# Altium schematic sheet HC IR SSR DRIVER.SchDoc
size A4; DocumentNumber: 4; SheetNumber: ALT0056; SheetTotal: 21
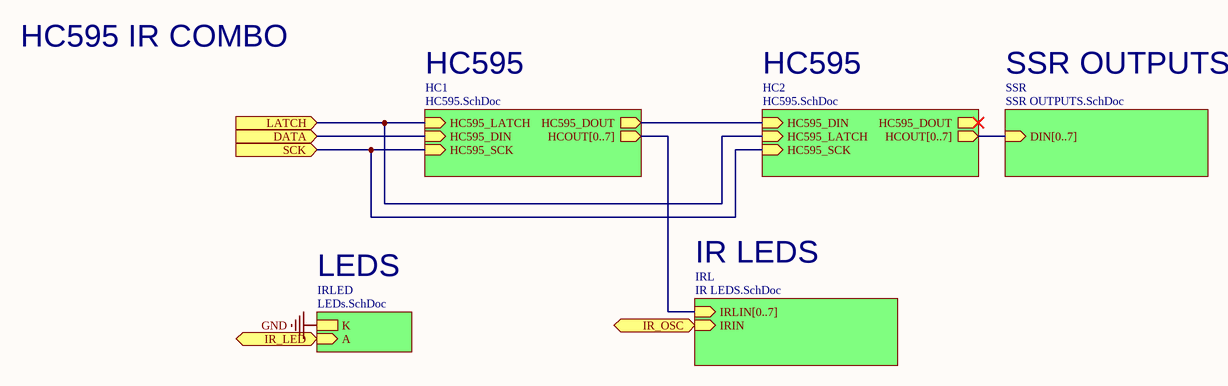
[diagram p0: HC IR SSR DRIVER.SchDoc]

## Sub-sheets
HC1 = HC595.SchDoc: HC595_LATCH (in), HC595_DIN (in), HC595_SCK (in), HC595_DOUT (out), HCOUT[0..7] (out)
HC2 = HC595.SchDoc: HC595_LATCH (in), HC595_DIN (in), HC595_SCK (in), HCOUT[0..7] (out), HC595_DOUT (out)
IRL = IR LEDS.SchDoc: IRLIN[0..7] (in), IRIN (in)
IRLED = LEDs.SchDoc: K, A (in)
SSR = SSR OUTPUTS.SchDoc: DIN[0..7] (in)

## Ports
DATA (in), IR_LED (in), IR_OSC (in), LATCH (in), SCK (in)

## Nets
GND: sheet IRLED/K
DATA: port DATA, sheet HC1/HC595_DIN
IR_LED: port IR_LED, sheet IRLED/A
IR_OSC: port IR_OSC, sheet IRL/IRIN
LATCH: port LATCH, sheet HC1/HC595_LATCH, sheet HC2/HC595_LATCH
SCK: port SCK, sheet HC1/HC595_SCK, sheet HC2/HC595_SCK
(unnamed): sheet HC1/HC595_DOUT, sheet HC2/HC595_DIN

## Buses and harness runs
bus sheet HC1/HCOUT[0..7] = sheet IRL/IRLIN[0..7]
bus sheet HC2/HCOUT[0..7] = sheet SSR/DIN[0..7]

## Notes on the sheet
- HC595 IR COMBO
- HC595
- SSR OUTPUTS
- IR LEDS
- LEDS
- Title
- Size:
- Date:
- A4
- Number:
- Time:
- Revision:
- Sheet
- of
- File: